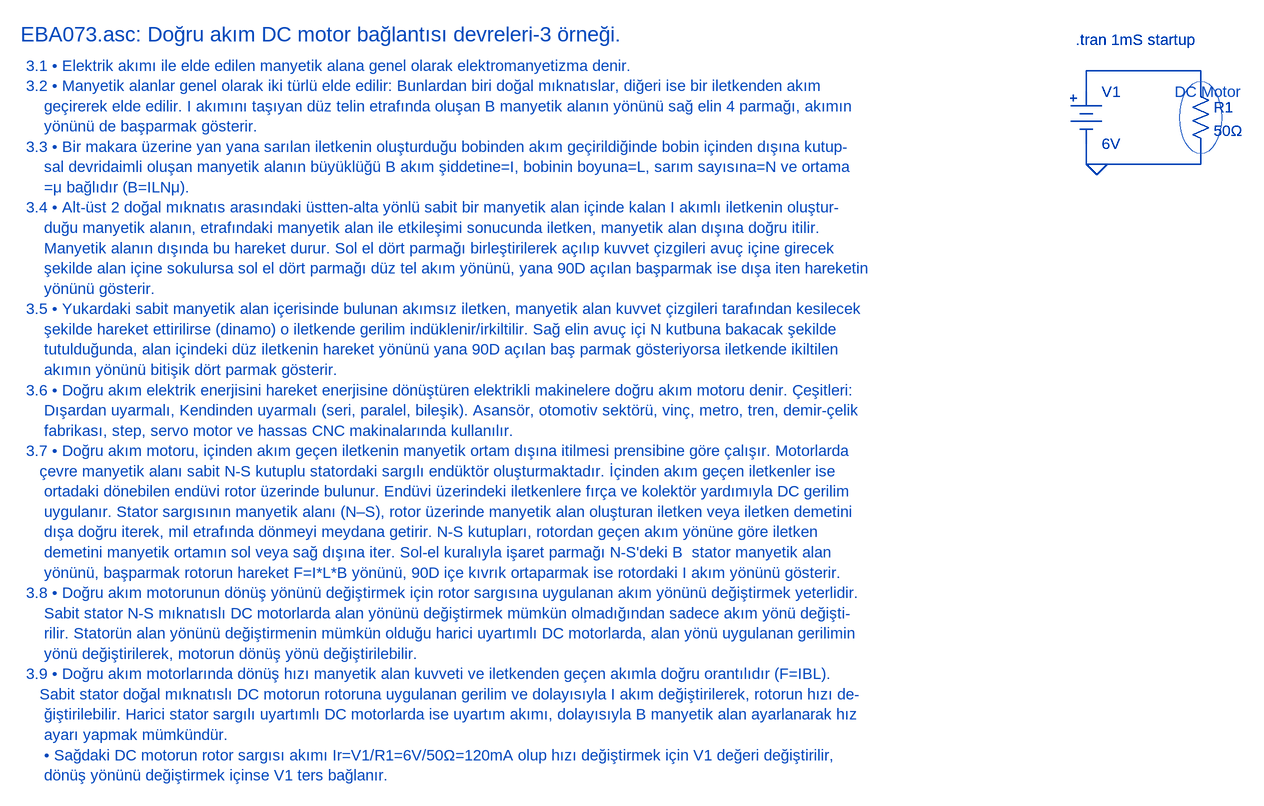
[diagram p0: schematic EBA073.asc]
EBA073.asc, the LTspice schematic file:
Version 4
SHEET 1 4076 2612
WIRE 1664 96 1488 96
WIRE 1488 128 1488 96
WIRE 1664 128 1664 96
WIRE 1488 240 1488 208
WIRE 1504 240 1488 240
WIRE 1664 240 1664 208
WIRE 1664 240 1504 240
FLAG 1504 240 0
SYMBOL Misc\\battery 1488 112 R0
SYMATTR InstName V1
SYMATTR Value 6V
SYMBOL res 1648 112 R0
SYMATTR InstName R1
SYMATTR Value 50Ω
TEXT -152 40 Left 3 ;EBA073.asc: Doğru akım DC motor bağlantısı devreleri-3 örneği.
TEXT -144 88 Left 2 ;3.1 • Elektrik akımı ile elde edilen manyetik alana genel olarak elektromanyetizma denir.\n3.2 • Manyetik alanlar genel olarak iki türlü elde edilir: Bunlardan biri doğal mıknatıslar, diğeri ise bir iletkenden akım \n    geçirerek elde edilir. I akımını taşıyan düz telin etrafında oluşan B manyetik alanın yönünü sağ elin 4 parmağı, akımın \n    yönünü de başparmak gösterir.\n3.3 • Bir makara üzerine yan yana sarılan iletkenin oluşturduğu bobinden akım geçirildiğinde bobin içinden dışına kutup-\n    sal devridaimli oluşan manyetik alanın büyüklüğü B akım şiddetine=I, bobinin boyuna=L, sarım sayısına=N ve ortama\n    =μ bağlıdır (B=ILNμ).\n3.4 • Alt-üst 2 doğal mıknatıs arasındaki üstten-alta yönlü sabit bir manyetik alan içinde kalan I akımlı iletkenin oluştur-\n    duğu manyetik alanın, etrafındaki manyetik alan ile etkileşimi sonucunda iletken, manyetik alan dışına doğru itilir. \n    Manyetik alanın dışında bu hareket durur. Sol el dört parmağı birleştirilerek açılıp kuvvet çizgileri avuç içine girecek\n    şekilde alan içine sokulursa sol el dört parmağı düz tel akım yönünü, yana 90D açılan başparmak ise dışa iten hareketin\n    yönünü gösterir.\n3.5 • Yukardaki sabit manyetik alan içerisinde bulunan akımsız iletken, manyetik alan kuvvet çizgileri tarafından kesilecek\n    şekilde hareket ettirilirse (dinamo) o iletkende gerilim indüklenir/irkiltilir. Sağ elin avuç içi N kutbuna bakacak şekilde \n    tutulduğunda, alan içindeki düz iletkenin hareket yönünü yana 90D açılan baş parmak gösteriyorsa iletkende ikiltilen\n    akımın yönünü bitişik dört parmak gösterir.\n3.6 • Doğru akım elektrik enerjisini hareket enerjisine dönüştüren elektrikli makinelere doğru akım motoru denir. Çeşitleri:\n    Dışardan uyarmalı, Kendinden uyarmalı (seri, paralel, bileşik). Asansör, otomotiv sektörü, vinç, metro, tren, demir-çelik\n    fabrikası, step, servo motor ve hassas CNC makinalarında kullanılır.\n3.7 • Doğru akım motoru, içinden akım geçen iletkenin manyetik ortam dışına itilmesi prensibine göre çalışır. Motorlarda\n   çevre manyetik alanı sabit N-S kutuplu statordaki sargılı endüktör oluşturmaktadır. İçinden akım geçen iletkenler ise \n    ortadaki dönebilen endüvi rotor üzerinde bulunur. Endüvi üzerindeki iletkenlere fırça ve kolektör yardımıyla DC gerilim \n    uygulanır. Stator sargısının manyetik alanı (N–S), rotor üzerinde manyetik alan oluşturan iletken veya iletken demetini \n    dışa doğru iterek, mil etrafında dönmeyi meydana getirir. N-S kutupları, rotordan geçen akım yönüne göre iletken \n    demetini manyetik ortamın sol veya sağ dışına iter. Sol-el kuralıyla işaret parmağı N-S'deki B  stator manyetik alan\n    yönünü, başparmak rotorun hareket F=I*L*B yönünü, 90D içe kıvrık ortaparmak ise rotordaki I akım yönünü gösterir.\n3.8 • Doğru akım motorunun dönüş yönünü değiştirmek için rotor sargısına uygulanan akım yönünü değiştirmek yeterlidir.\n    Sabit stator N-S mıknatıslı DC motorlarda alan yönünü değiştirmek mümkün olmadığından sadece akım yönü değişti-\n    rilir. Statorün alan yönünü değiştirmenin mümkün olduğu harici uyartımlı DC motorlarda, alan yönü uygulanan gerilimin\n    yönü değiştirilerek, motorun dönüş yönü değiştirilebilir.\n3.9 • Doğru akım motorlarında dönüş hızı manyetik alan kuvveti ve iletkenden geçen akımla doğru orantılıdır (F=IBL). \n   Sabit stator doğal mıknatıslı DC motorun rotoruna uygulanan gerilim ve dolayısıyla I akım değiştirilerek, rotorun hızı de-\n    ğiştirilebilir. Harici stator sargılı uyartımlı DC motorlarda ise uyartım akımı, dolayısıyla B manyetik alan ayarlanarak hız \n    ayarı yapmak mümkündür.\n    • Sağdaki DC motorun rotor sargısı akımı Ir=V1/R1=6V/50Ω=120mA olup hızı değiştirmek için V1 değeri değiştirilir,\n    dönüş yönünü değiştirmek içinse V1 ters bağlanır.
TEXT 1472 48 Left 2 !.tran 1mS startup
TEXT 1624 128 Left 2 ;DC Motor
CIRCLE Normal 1696 224 1632 112 2

The netlist it stands for:
* EBA073.asc
V1 N001 0 6V
R1 N001 0 50Ω
* EBA073.asc: Doğru akım DC motor bağlantısı devreleri-3 örneği.
* 3.1 • Elektrik akımı ile elde edilen manyetik alana genel olarak elektromanyetizma denir.
* 3.2 • Manyetik alanlar genel olarak iki türlü elde edilir: Bunlardan biri doğal mıknatıslar, diğeri ise bir iletkenden akım
*     geçirerek elde edilir. I akımını taşıyan düz telin etrafında oluşan B manyetik alanın yönünü sağ elin 4 parmağı, akımın
*     yönünü de başparmak gösterir.
* 3.3 • Bir makara üzerine yan yana sarılan iletkenin oluşturduğu bobinden akım geçirildiğinde bobin içinden dışına kutup-
*     sal devridaimli oluşan manyetik alanın büyüklüğü B akım şiddetine=I, bobinin boyuna=L, sarım sayısına=N ve ortama
*     =μ bağlıdır (B=ILNμ).
* 3.4 • Alt-üst 2 doğal mıknatıs arasındaki üstten-alta yönlü sabit bir manyetik alan içinde kalan I akımlı iletkenin oluştur-
*     duğu manyetik alanın, etrafındaki manyetik alan ile etkileşimi sonucunda iletken, manyetik alan dışına doğru itilir.
*     Manyetik alanın dışında bu hareket durur. Sol el dört parmağı birleştirilerek açılıp kuvvet çizgileri avuç içine girecek
*     şekilde alan içine sokulursa sol el dört parmağı düz tel akım yönünü, yana 90D açılan başparmak ise dışa iten hareketin
*     yönünü gösterir.
* 3.5 • Yukardaki sabit manyetik alan içerisinde bulunan akımsız iletken, manyetik alan kuvvet çizgileri tarafından kesilecek
*     şekilde hareket ettirilirse (dinamo) o iletkende gerilim indüklenir/irkiltilir. Sağ elin avuç içi N kutbuna bakacak şekilde
*     tutulduğunda, alan içindeki düz iletkenin hareket yönünü yana 90D açılan baş parmak gösteriyorsa iletkende ikiltilen
*     akımın yönünü bitişik dört parmak gösterir.
* 3.6 • Doğru akım elektrik enerjisini hareket enerjisine dönüştüren elektrikli makinelere doğru akım motoru denir. Çeşitleri:
*     Dışardan uyarmalı, Kendinden uyarmalı (seri, paralel, bileşik). Asansör, otomotiv sektörü, vinç, metro, tren, demir-çelik
*     fabrikası, step, servo motor ve hassas CNC makinalarında kullanılır.
* 3.7 • Doğru akım motoru, içinden akım geçen iletkenin manyetik ortam dışına itilmesi prensibine göre çalışır. Motorlarda
*    çevre manyetik alanı sabit N-S kutuplu statordaki sargılı endüktör oluşturmaktadır. İçinden akım geçen iletkenler ise
*     ortadaki dönebilen endüvi rotor üzerinde bulunur. Endüvi üzerindeki iletkenlere fırça ve kolektör yardımıyla DC gerilim
*     uygulanır. Stator sargısının manyetik alanı (N–S), rotor üzerinde manyetik alan oluşturan iletken veya iletken demetini
*     dışa doğru iterek, mil etrafında dönmeyi meydana getirir. N-S kutupları, rotordan geçen akım yönüne göre iletken
*     demetini manyetik ortamın sol veya sağ dışına iter. Sol-el kuralıyla işaret parmağı N-S'deki B  stator manyetik alan
*     yönünü, başparmak rotorun hareket F=I*L*B yönünü, 90D içe kıvrık ortaparmak ise rotordaki I akım yönünü gösterir.
* 3.8 • Doğru akım motorunun dönüş yönünü değiştirmek için rotor sargısına uygulanan akım yönünü değiştirmek yeterlidir.
*     Sabit stator N-S mıknatıslı DC motorlarda alan yönünü değiştirmek mümkün olmadığından sadece akım yönü değişti-
*     rilir. Statorün alan yönünü değiştirmenin mümkün olduğu harici uyartımlı DC motorlarda, alan yönü uygulanan gerilimin
*     yönü değiştirilerek, motorun dönüş yönü değiştirilebilir.
* 3.9 • Doğru akım motorlarında dönüş hızı manyetik alan kuvveti ve iletkenden geçen akımla doğru orantılıdır (F=IBL).
*    Sabit stator doğal mıknatıslı DC motorun rotoruna uygulanan gerilim ve dolayısıyla I akım değiştirilerek, rotorun hızı de-
*     ğiştirilebilir. Harici stator sargılı uyartımlı DC motorlarda ise uyartım akımı, dolayısıyla B manyetik alan ayarlanarak hız
*     ayarı yapmak mümkündür.
*     • Sağdaki DC motorun rotor sargısı akımı Ir=V1/R1=6V/50Ω=120mA olup hızı değiştirmek için V1 değeri değiştirilir,
*     dönüş yönünü değiştirmek içinse V1 ters bağlanır.
.tran 1mS startup
* DC Motor
.backanno
.end